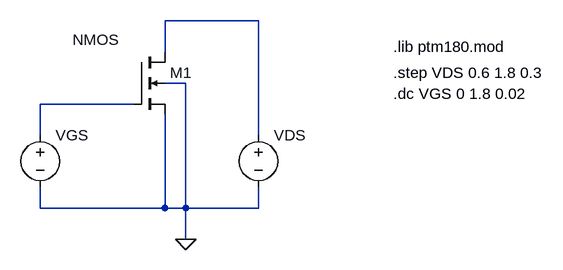
[diagram p0: schematic Draft1.asc]
Draft1.asc, the LTspice schematic file:
Version 4
SHEET 1 900 680
WIRE 432 -64 288 -64
WIRE 288 -16 288 -64
WIRE 320 32 288 32
WIRE 240 64 96 64
WIRE 96 112 96 64
WIRE 432 112 432 -64
WIRE 96 224 96 192
WIRE 288 224 288 80
WIRE 288 224 96 224
WIRE 320 224 320 32
WIRE 320 224 288 224
WIRE 432 224 432 192
WIRE 432 224 320 224
WIRE 320 272 320 224
FLAG 320 272 0
SYMBOL voltage 96 96 R0
WINDOW 123 0 0 Left 0
WINDOW 39 0 0 Left 0
SYMATTR InstName VGS
SYMATTR Value ""
SYMBOL voltage 432 96 R0
WINDOW 123 0 0 Left 0
WINDOW 39 0 0 Left 0
SYMATTR InstName VDS
SYMATTR Value ""
SYMBOL nmos4 240 -16 R0
WINDOW 3 -94 -19 Left 2
SYMATTR InstName M1
SYMATTR Value2 l=180e-9 w=180e-8
TEXT 640 -24 Left 2 !.lib ptm180.mod
TEXT 640 16 Left 2 !.step VDS 0.6 1.8 0.3
TEXT 640 48 Left 2 !.dc VGS 0 1.8 0.02

The netlist it stands for:
* Draft1.asc
VGS N002 0
VDS N001 0
M1 N001 N002 0 0 NMOS l=180e-9 w=180e-8
.model NMOS NMOS
.model PMOS PMOS
.lib standard.mos
.lib ptm180.mod
.step VDS 0.6 1.8 0.3
.dc VGS 0 1.8 0.02
.backanno
.end